# EAGLE design kontroller2 (EAGLE 7.6.0)
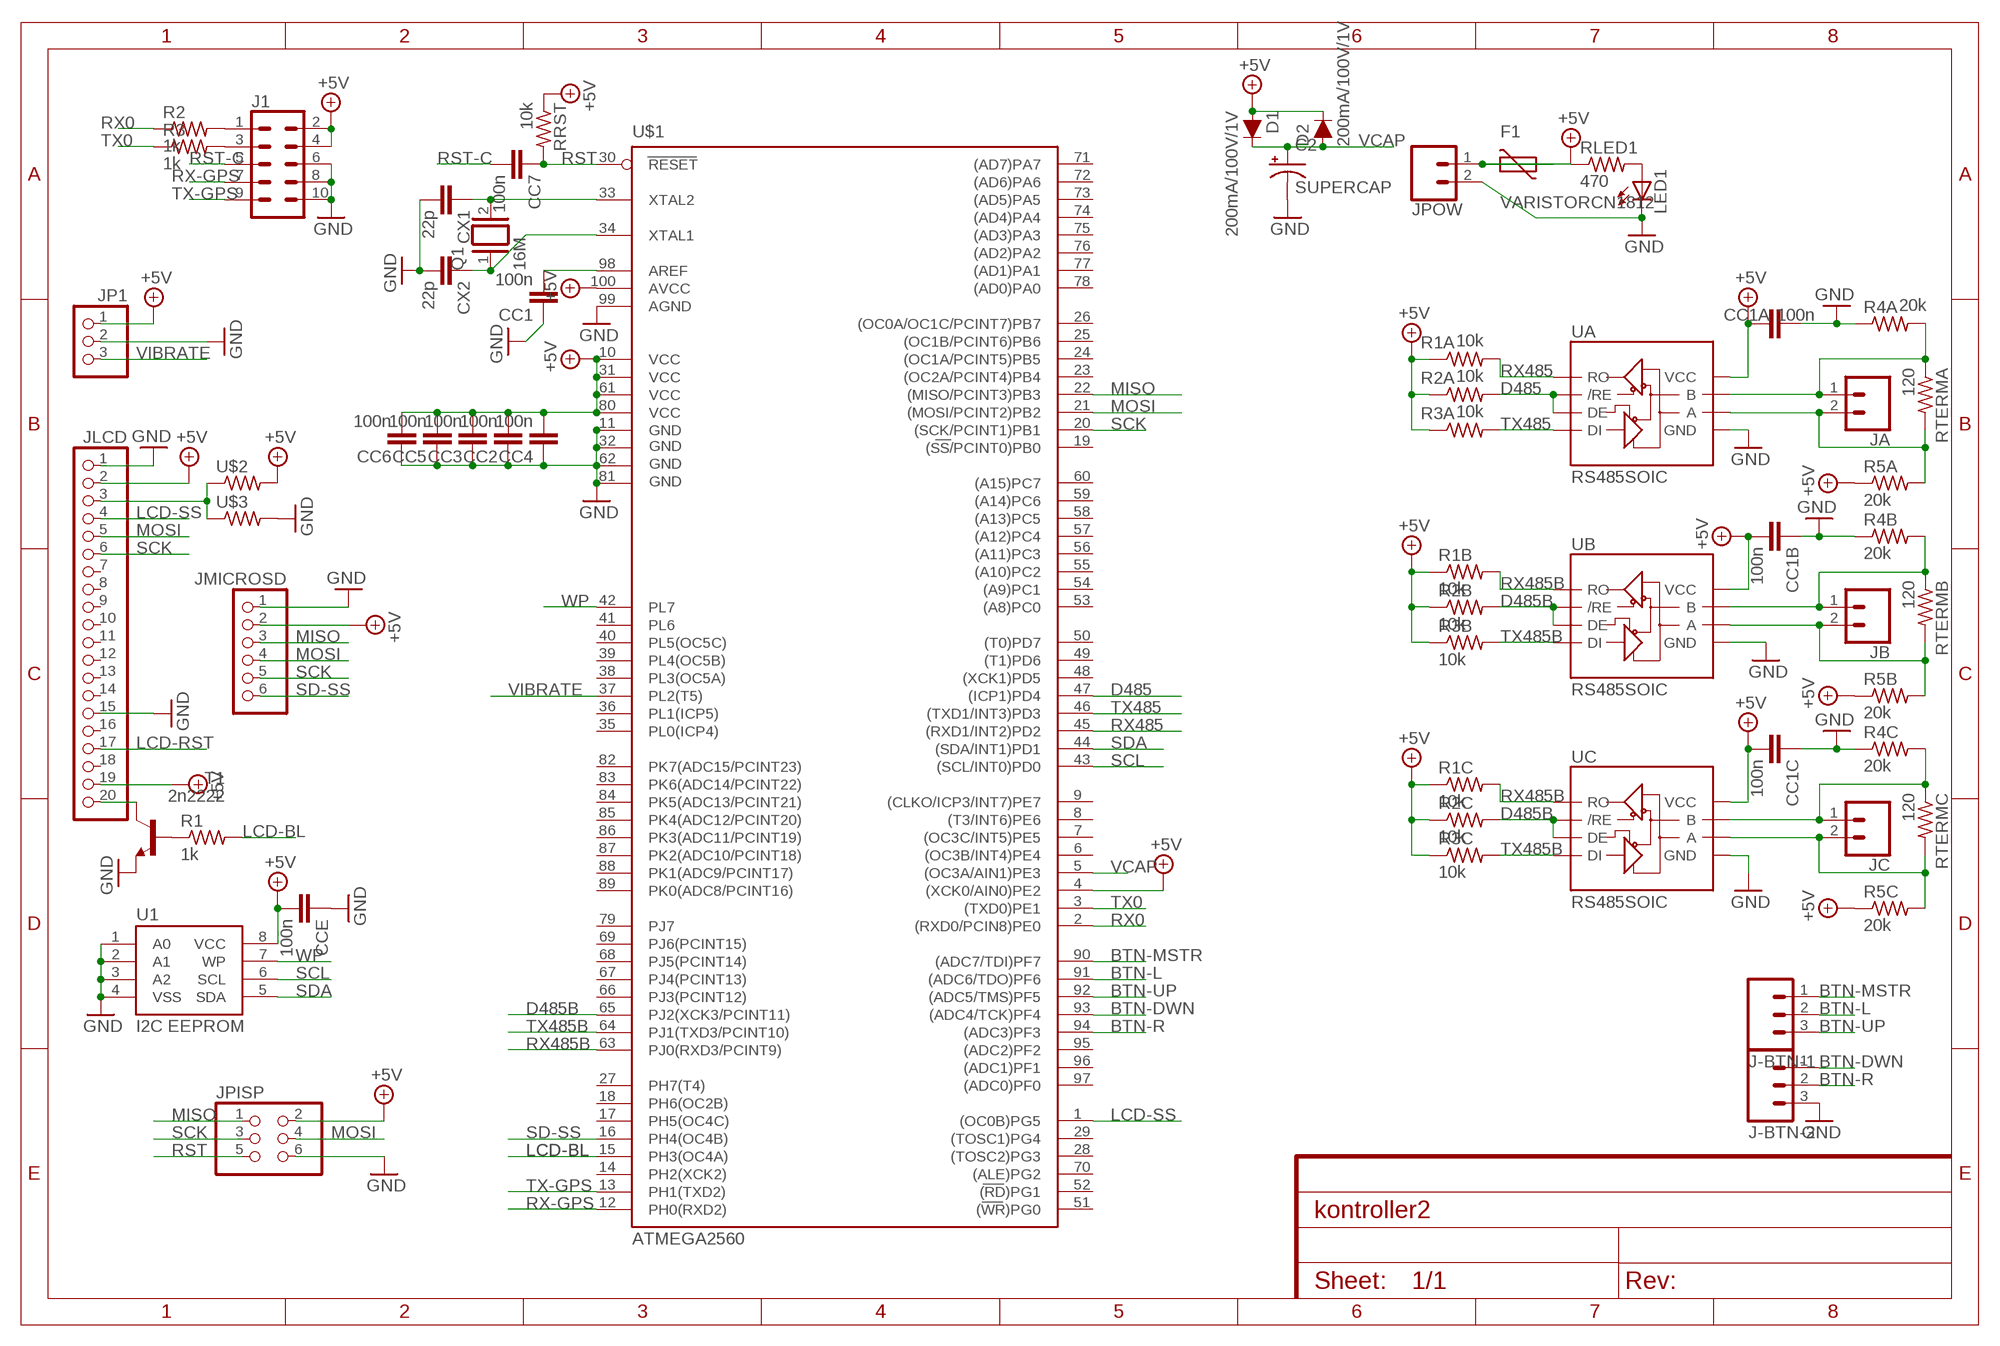
[diagram p0: schematic, sheet 1]

## Parts
C2  SUPERCAP  [SUPERCAP-25MM]
CC1  100n  CAP-NPOL_C0805  [C0805]
CC1A  100n  CAP-NPOL_C0805  [C0805]
CC1B  100n  CAP-NPOL_C0805  [C0805]
CC1C  100n  CAP-NPOL_C0805  [C0805]
CC2  100n  CAP-NPOL_C0805  [C0805]
CC3  100n  CAP-NPOL_C0805  [C0805]
CC4  100n  CAP-NPOL_C0805  [C0805]
CC5  100n  CAP-NPOL_C0805  [C0805]
CC6  100n  CAP-NPOL_C0805  [C0805]
CC7  100n  CAP-NPOL_C0805  [C0805]
CCE  100n  CAP-NPOL_C0805  [C0805]
CX1  22p  CAP-NPOL_C0805  [C0805]
CX2  22p  CAP-NPOL_C0805  [C0805]
D1  200mA/100V/1V  DIODE-1N4148  [DIODE-1N4148]
D2  200mA/100V/1V  DIODE-1N4148  [DIODE-1N4148]
F1  VARISTORCN1812  [CT/CN1812]
J1  CONN_05X2SHD_LOCK  [2X5-SHROUDED_LOCK]
J-BTN-1  M03-SCREW-5MM  [SCREWTERMINAL-5MM-3]
J-BTN-2  M03-SCREW-5MM  [SCREWTERMINAL-5MM-3]
JA  CONN_025MM  [SCREWTERMINAL-5MM-2]
JB  CONN_025MM  [SCREWTERMINAL-5MM-2]
JC  CONN_025MM  [SCREWTERMINAL-5MM-2]
JLCD  PINHD-1X20  [1X20]
JMICROSD  PINHD-1X6  [1X06]
JP1  PINHD-1X3  [1X03]
JPISP  PINHD-2X3  [2X03]
JPOW  CONN_025MM  [SCREWTERMINAL-5MM-2]
LED1  LED3MM  [LED3MM]
Q1  16M  XTAL/S  [QS]
R1  1k  RES_R0805  [R0805]
R1A  10k  RES_R0805  [R0805]
R1B  10k  RES_R0805  [R0805]
R1C  10k  RES_R0805  [R0805]
R2  1k  RES_R0805  [R0805]
R2A  10k  RES_R0805  [R0805]
R2B  10k  RES_R0805  [R0805]
R2C  10k  RES_R0805  [R0805]
R3  1k  RES_R0805  [R0805]
R3A  10k  RES_R0805  [R0805]
R3B  10k  RES_R0805  [R0805]
R3C  10k  RES_R0805  [R0805]
R4A  20k  RES_TH3  [RES-0.3]
R4B  20k  RES_TH3  [RES-0.3]
R4C  20k  RES_TH3  [RES-0.3]
R5A  20k  RES_TH3  [RES-0.3]
R5B  20k  RES_TH3  [RES-0.3]
R5C  20k  RES_TH3  [RES-0.3]
RLED1  470  RES_R0805  [R0805]
RRST  10k  RES_R0805  [R0805]
RTERMA  120  RES_R0805  [R0805]
RTERMB  120  RES_R0805  [R0805]
RTERMC  120  RES_R0805  [R0805]
T1  2n2222  2N2222-NPN-TO92-EBC  [TO92-EBC]
U1  I2C EEPROM  EEPROM-I2CEIAJ  [SO08-EIAJ]
U$1  ATMEGA2560  [TQFP100]
U$2  RES_R0805  [R0805]
U$3  RES_R0805  [R0805]
UA  RS485SOIC  [SO08]
UB  RS485SOIC  [SO08]
UC  RS485SOIC  [SO08]

## Nets
+5V: CC1A.2 CC1B.2 CC1C.2 CC2.2 CC3.2 CC4.2 CC5.2 CC6.2 CCE.2 D1.A D2.C F1.2 J1.2 J1.4 JLCD.2 JLCD.19 JMICROSD.2 JP1.1 JPISP.2 R1A.1 R1B.1 R1C.1 R2A.1 R2B.1 R2C.1 R3A.1 R3B.1 R3C.1 R5A.1 R5B.1 R5C.1 RLED1.1 RRST.1 U1.8(VCC) U$1.4((XCK0/AIN0)PE2) U$1.10(VCC) U$1.31(VCC1) U$1.61(VCC2) U$1.80(VCC3) U$1.100(AVCC) U$2.2 UA.8(VCC) UB.8(VCC) UC.8(VCC)
AREF: CC1.2 U$1.98(AREF)
BTN-DWN: J-BTN-2.1 U$1.93((ADC4/TCK)PF4)
BTN-L: J-BTN-1.2 U$1.91((ADC6/TDO)PF6)
BTN-MSTR: J-BTN-1.1 U$1.90((ADC7/TDI)PF7)
BTN-R: J-BTN-2.2 U$1.94((ADC3)PF3)
BTN-UP: J-BTN-1.3 U$1.92((ADC5/TMS)PF5)
D485: R2A.2 U$1.47((ICP1)PD4) UA.2(/RE) UA.3(DE)
D485B: R2B.2 R2C.2 U$1.65(PJ2(XCK3/PCINT11)) UB.2(/RE) UB.3(DE) UC.2(/RE) UC.3(DE)
GND: C2.- CC1.1 CC1A.1 CC1B.1 CC1C.1 CC2.1 CC3.1 CC4.1 CC5.1 CC6.1 CCE.1 CX1.2 CX2.2 J1.6 J1.8 J1.10 J-BTN-2.3 JLCD.1 JLCD.15 JMICROSD.1 JP1.2 JPISP.6 JPOW.2 LED1.K(C) R4A.1 R4B.1 R4C.1 T1.E U1.1(A0) U1.2(A1) U1.3(A2) U1.4(VSS) U$1.11(GND) U$1.32(GND1) U$1.62(GND2) U$1.81(GND3) U$1.99(AGND) U$3.2 UA.5(GND) UB.5(GND) UC.5(GND)
LCD-BL: R1.2 U$1.15(PH3(OC4A))
LCD-RST: JLCD.17
LCD-SS: JLCD.4 U$1.1((OC0B)PG5)
MISO: JMICROSD.3 JPISP.1 U$1.22((MISO/PCINT3)PB3)
MOSI: JLCD.5 JMICROSD.4 JPISP.4 U$1.21((MOSI/PCINT2)PB2)
N$1: JA.2 R5A.2 RTERMA.2 UA.6(A)
N$2: JC.1 R4C.2 RTERMC.1 UC.7(B)
N$3: JB.1 R4B.2 RTERMB.1 UB.7(B)
N$4: JB.2 R5B.2 RTERMB.2 UB.6(A)
N$5: CX1.1 Q1.2 U$1.33(XTAL2)
N$6: CX2.1 Q1.1 U$1.34(XTAL1)
N$8: LED1.A RLED1.2
N$20: JLCD.3 U$2.1 U$3.1
N$21: JLCD.20 T1.C
N$23: R1.1 T1.B
N$24: J1.1 R2.2
N$25: J1.3 R3.2
N$26: F1.1 JPOW.1
N$28: JC.2 R5C.2 RTERMC.2 UC.6(A)
N$29: JA.1 R4A.2 RTERMA.1 UA.7(B)
RST: CC7.1 JPISP.5 RRST.2 U$1.30(RESET)
RST-C: CC7.2 J1.5
RX0: R2.1 U$1.2((RXD0/PCIN8)PE0)
RX485: R1A.2 U$1.45((RXD1/INT2)PD2) UA.1(RO)
RX485B: R1B.2 R1C.2 U$1.63(PJ0(RXD3/PCINT9)) UB.1(RO) UC.1(RO)
RX-GPS: J1.7 U$1.12(PH0(RXD2))
SCK: JLCD.6 JMICROSD.5 JPISP.3 U$1.20((SCK/PCINT1)PB1)
SCL: U1.6(SCL) U$1.43((SCL/INT0)PD0)
SD-SS: JMICROSD.6 U$1.16(PH4(OC4B))
SDA: U1.5(SDA) U$1.44((SDA/INT1)PD1)
TX0: R3.1 U$1.3((TXD0)PE1)
TX485: R3A.2 U$1.46((TXD1/INT3)PD3) UA.4(DI)
TX485B: R3B.2 R3C.2 U$1.64(PJ1(TXD3/PCINT10)) UB.4(DI) UC.4(DI)
TX-GPS: J1.9 U$1.13(PH1(TXD2))
VCAP: C2.+ D1.C D2.A U$1.5((OC3A/AIN1)PE3)
VIBRATE: JP1.3 U$1.37(PL2(T5))
WP: U1.7(WP) U$1.42(PL7)
Unconnected: JLCD.7 JLCD.8 JLCD.9 JLCD.10 JLCD.11 JLCD.12 JLCD.13 JLCD.14 JLCD.16 JLCD.18 U$1.6((OC3B/INT4)PE4) U$1.7((OC3C/INT5)PE5) U$1.8((T3/INT6)PE6) U$1.9((CLKO/ICP3/INT7)PE7) U$1.14(PH2(XCK2)) U$1.17(PH5(OC4C)) U$1.18(PH6(OC2B)) U$1.19((SS/PCINT0)PB0) U$1.23((OC2A/PCINT4)PB4) U$1.24((OC1A/PCINT5)PB5) U$1.25((OC1B/PCINT6)PB6) U$1.26((OC0A/OC1C/PCINT7)PB7) U$1.27(PH7(T4)) U$1.28((TOSC2)PG3) U$1.29((TOSC1)PG4) U$1.35(PL0(ICP4)) U$1.36(PL1(ICP5)) U$1.38(PL3(OC5A)) U$1.39(PL4(OC5B)) U$1.40(PL5(OC5C)) U$1.41(PL6) U$1.48((XCK1)PD5) U$1.49((T1)PD6) U$1.50((T0)PD7) U$1.51((WR)PG0) U$1.52((RD)PG1) U$1.53((A8)PC0) U$1.54((A9)PC1) U$1.55((A10)PC2) U$1.56((A11)PC3) U$1.57((A12)PC4) U$1.58((A13)PC5) U$1.59((A14)PC6) U$1.60((A15)PC7) U$1.66(PJ3(PCINT12)) U$1.67(PJ4(PCINT13)) U$1.68(PJ5(PCINT14)) U$1.69(PJ6(PCINT15)) U$1.70((ALE)PG2) U$1.71((AD7)PA7) U$1.72((AD6)PA6) U$1.73((AD5)PA5) U$1.74((AD4)PA4) U$1.75((AD3)PA3) U$1.76((AD2)PA2) U$1.77((AD1)PA1) U$1.78((AD0)PA0) U$1.79(PJ7) U$1.82(PK7(ADC15/PCINT23)) U$1.83(PK6(ADC14/PCINT22)) U$1.84(PK5(ADC13/PCINT21)) U$1.85(PK4(ADC12/PCINT20)) U$1.86(PK3(ADC11/PCINT19)) U$1.87(PK2(ADC10/PCINT18)) U$1.88(PK1(ADC9/PCINT17)) U$1.89(PK0(ADC8/PCINT16)) U$1.95((ADC2)PF2) U$1.96((ADC1)PF1) U$1.97((ADC0)PF0)

## Library data of the parts
C2 = edes_lib_160827:SUPERCAP
CC1 CC1A CC1B CC1C CC2-CC7 CCE CX1 CX2 = edes_lib_160827:CAP-NPOL
D1 D2 = SparkFun-DiscreteSemi:DIODE: Diode These are standard reverse protection diodes and small signal diodes. SparkFun Products: SparkFun SparkPunk Sound Kit <https://www.sparkfun.com/products/11177> SparkFun ESP8266 Thing <https://www.sparkfun.com/products/13231>; PROD_ID: DIO-08378
F1 = varistor:VARISTOR: VARISTOR
J1 = edes_lib_160827:CONN_05X2: Multi connection point. Often used as Generic Header-pin footprint for 0.1 inch spaced/style header connections For AVR SPI programming port, see special device with nice symbol: "AVR_SPI_PROG_5x2.dev" You can populate with any combo of single row headers, but if you'd like an exact match, check these: 2x5 AVR ICSP Male Header <https://www.sparkfun.com/products/778> (PRT-00778) 2x5 Pin Shrouded Header <https://www.sparkfun.com/products/8506> (PRT-08506) On any of the 0.1 inch spaced packages, you can populate with these: Break Away Headers - Straight <https://www.sparkfun.com/products/116> (PRT-00116) Break Away Male Headers - Right Angle <https://www.sparkfun.com/products/553> (PRT-00553) Female Headers <https://www.sparkfun.com/products/115> (PRT-00115) Break Away Headers - Machine Pin <https://www.sparkfun.com/products/117> (PRT-00117) Break Away Female Headers - Swiss Machine Pin <https://www.sparkfun.com/products/743> (PRT-00743) Special note: the shrouded connector mates well with our 5x2 ribbon cables: 2x5 Pin IDC Ribbon Cable <https://www.sparkfun.com/products/8535> (PRT-08535); PROD_ID: CONN-08671; SF_ID: PRT-08506
J-BTN-1 J-BTN-2 = SparkFun-Connectors:M03: Header 3 Standard 3-pin 0.1" header. Use with straight break away headers (SKU : PRT-00116), right angle break away headers (PRT-00553), swiss pins (PRT-00743), machine pins (PRT-00117), and female headers (PRT-00115). Molex polarized connector foot print use with SKU : PRT-08232 with associated crimp pins and housings.; STOREFRONT_ID: PRT-08433
JA JB JC JPOW = SparkFun-Connectors:CONN_02: Multi connection point. Often used as Generic Header-pin footprint for 0.1 inch spaced/style header connections On any of the 0.1 inch spaced packages, you can populate with these: Break Away Headers - Straight <https://www.sparkfun.com/products/116> (PRT-00116) Break Away Male Headers - Right Angle <https://www.sparkfun.com/products/553> (PRT-00553) Female Headers <https://www.sparkfun.com/products/115> (PRT-00115) Break Away Headers - Machine Pin <https://www.sparkfun.com/products/117> (PRT-00117) Break Away Female Headers - Swiss Machine Pin <https://www.sparkfun.com/products/743> (PRT-00743) For SCREWTERMINALS and SPRING TERMINALS visit here: Screw Terimnals on SparkFun.com <https://www.sparkfun.com/search/results?term=Screw+Terminals> (5mm/3.5mm/2.54mm spacing) This device is also useful as a general connection point to wire up your design to another part of your project. Our various solder wires solder well into these plated through hole pads. Hook-Up Wire - Assortment (Stranded, 22 AWG) <https://www.sparkfun.com/products/11375> (PRT-11375) Hook-Up Wire - Assortment (Solid Core, 22 AWG) <https://www.sparkfun.com/products/11367> (PRT-11367) View the entire wire category on our website here <https://www.sparkfun.com/categories/141> Special notes: Molex polarized connector foot print use with: PRT-08233 with associated crimp pins and housings. 2.54_SCREWTERM for use with PRT-10571. 3.5mm Screw Terminal footprints for PRT-08084 5mm Screw Terminal footprints for use with PRT-08432; SF_SKU: PRT-08432
JLCD = pinhead:PINHD-1X20: PIN HEADER
JMICROSD = pinhead:PINHD-1X6: PIN HEADER
JP1 = pinhead:PINHD-1X3: PIN HEADER
JPISP = pinhead:PINHD-2X3: PIN HEADER
LED1 = edes_lib_160827:LED: LED OSRAM: - CHIPLED LG R971, LG N971, LY N971, LG Q971, LY Q971, LO R971, LY R971 LH N974, LH R974 LS Q976, LO Q976, LY Q976 LO Q996 - Hyper CHIPLED LW Q18S LB Q993, LB Q99A, LB R99A - SideLED LS A670, LO A670, LY A670, LG A670, LP A670 LB A673, LV A673, LT A673, LW A673 LH A674 LY A675 LS A676, LA A676, LO A676, LY A676, LW A676 LS A679, LY A679, LG A679 - Hyper Micro SIDELED® LS Y876, LA Y876, LO Y876, LY Y876 LT Y87S - SmartLED LW L88C, LW L88S LB L89C, LB L89S, LG L890 LS L89K, LO L89K, LY L89K LS L896, LA L896, LO L896, LY L896 - TOPLED LS T670, LO T670, LY T670, LG T670, LP T670 LSG T670, LSP T670, LSY T670, LOP T670, LYG T670 LG T671, LOG T671, LSG T671 LB T673, LV T673, LT T673, LW T673 LH T674 LS T676, LA T676, LO T676, LY T676, LB T676, LH T676, LSB T676, LW T676 LB T67C, LV T67C, LT T67C, LS T67K, LO T67K, LY T67K, LW E67C LS E67B, LA E67B, LO E67B, LY E67B, LB E67C, LV E67C, LT E67C LW T67C LS T679, LY T679, LG T679 LS T770, LO T770, LY T770, LG T770, LP T770 LB T773, LV T773, LT T773, LW T773 LH T774 LS E675, LA E675, LY E675, LS T675 LS T776, LA T776, LO T776, LY T776, LB T776 LHGB T686 LT T68C, LB T68C - Hyper Mini TOPLED® LB M676 - Mini TOPLED Santana® LG M470 LS M47K, LO M47K, LY M47K Source: http://www.osram.convergy.de LUXEON: - LUMILED® LXK2-PW12-R00, LXK2-PW12-S00, LXK2-PW14-U00, LXK2-PW14-V00 LXK2-PM12-R00, LXK2-PM12-S00, LXK2-PM14-U00 LXK2-PE12-Q00, LXK2-PE12-R00, LXK2-PE12-S00, LXK2-PE14-T00, LXK2-PE14-U00 LXK2-PB12-K00, LXK2-PB12-L00, LXK2-PB12-M00, LXK2-PB14-N00, LXK2-PB14-P00, LXK2-PB14-Q00 LXK2-PR12-L00, LXK2-PR12-M00, LXK2-PR14-Q00, LXK2-PR14-R00 LXK2-PD12-Q00, LXK2-PD12-R00, LXK2-PD12-S00 LXK2-PH12-R00, LXK2-PH12-S00 LXK2-PL12-P00, LXK2-PL12-Q00, LXK2-PL12-R00 Source: www.luxeon.com KINGBRIGHT: KA-3528ASYC Source: www.kingbright.com
Q1 = special:XTAL/S: CRYSTAL
R1 R1A R1B R1C R2 R2A R2B R2C R3 R3A R3B R3C R4A R4B R4C R5A R5B R5C RLED1 RRST RTERMA RTERMB RTERMC U$2 U$3 = edes_lib_160827:RES
T1 = transistor-neu-to92:*-NPN-: NPN Transistror
U1 = SparkFun-IC-Memory:EEPROM-I2C: I2C EEPROMs, 24LC256 and others 24LC256 Series 256 kb I2C 2 Wire (32 k x 8 Bit) 2.5 V Serial EEPROM SMD - SOIC-8 Datasheet SparkFun Products SparkFun UDB5 - PIC UAV Development Board <https://www.sparkfun.com/products/11703> (GPS-11703); PROD_ID: NA-XXXXX
U$1 = edes_lib_160827:ATMEGA2560
UA UB UC = SparkFun-DigitalIC:RS485: RS485 transceiver

## Board
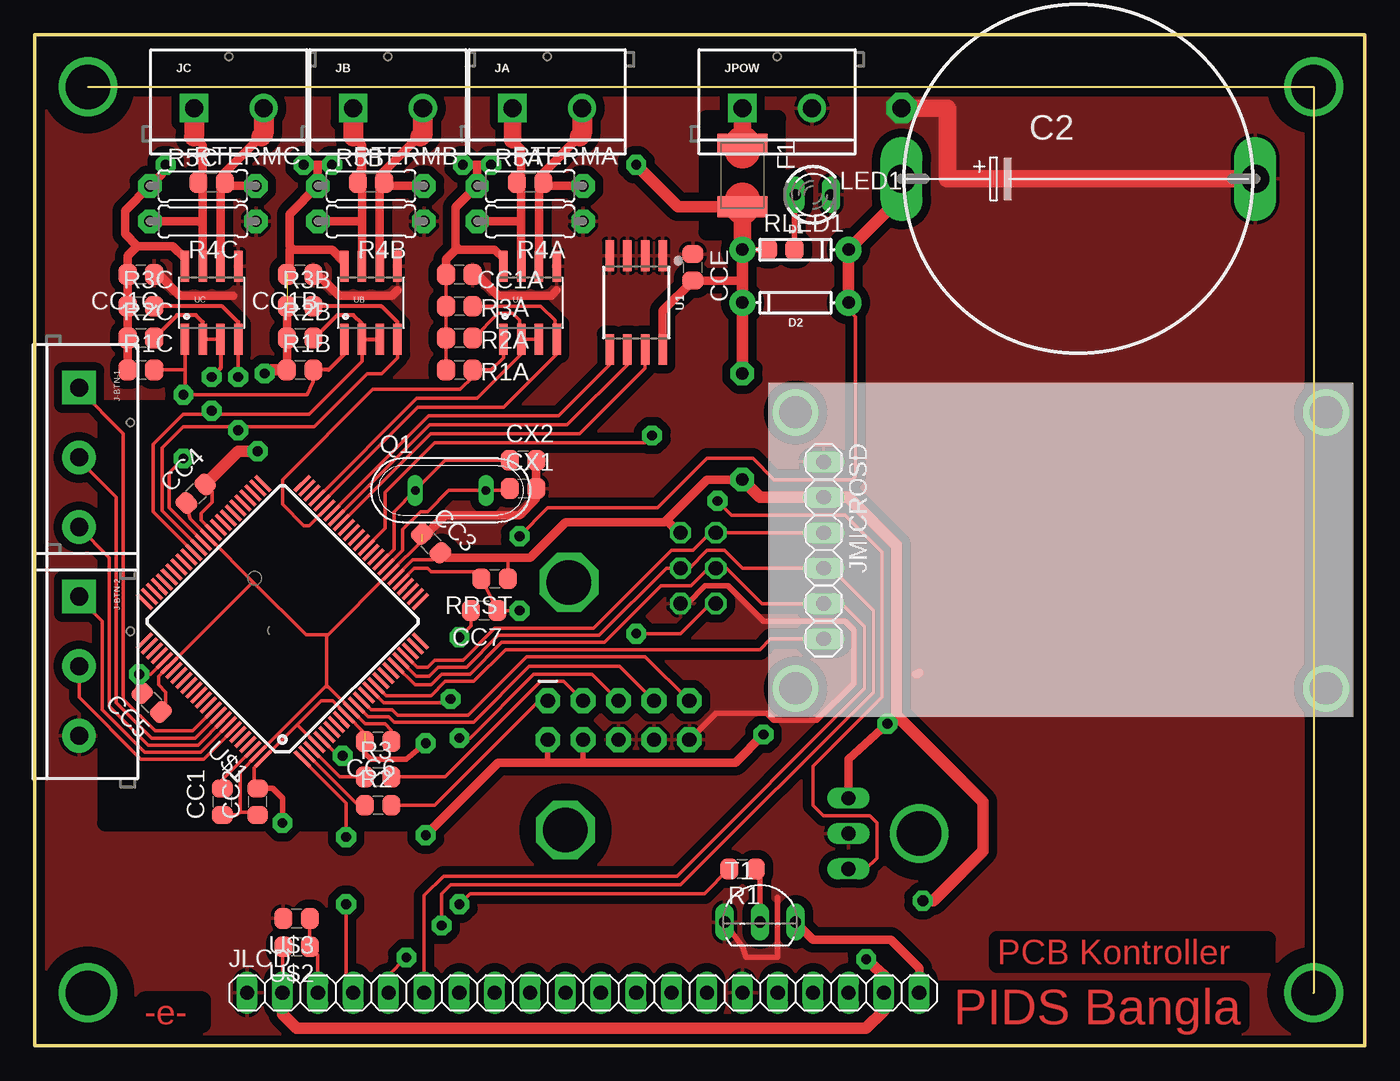
[diagram p1: board, top side]
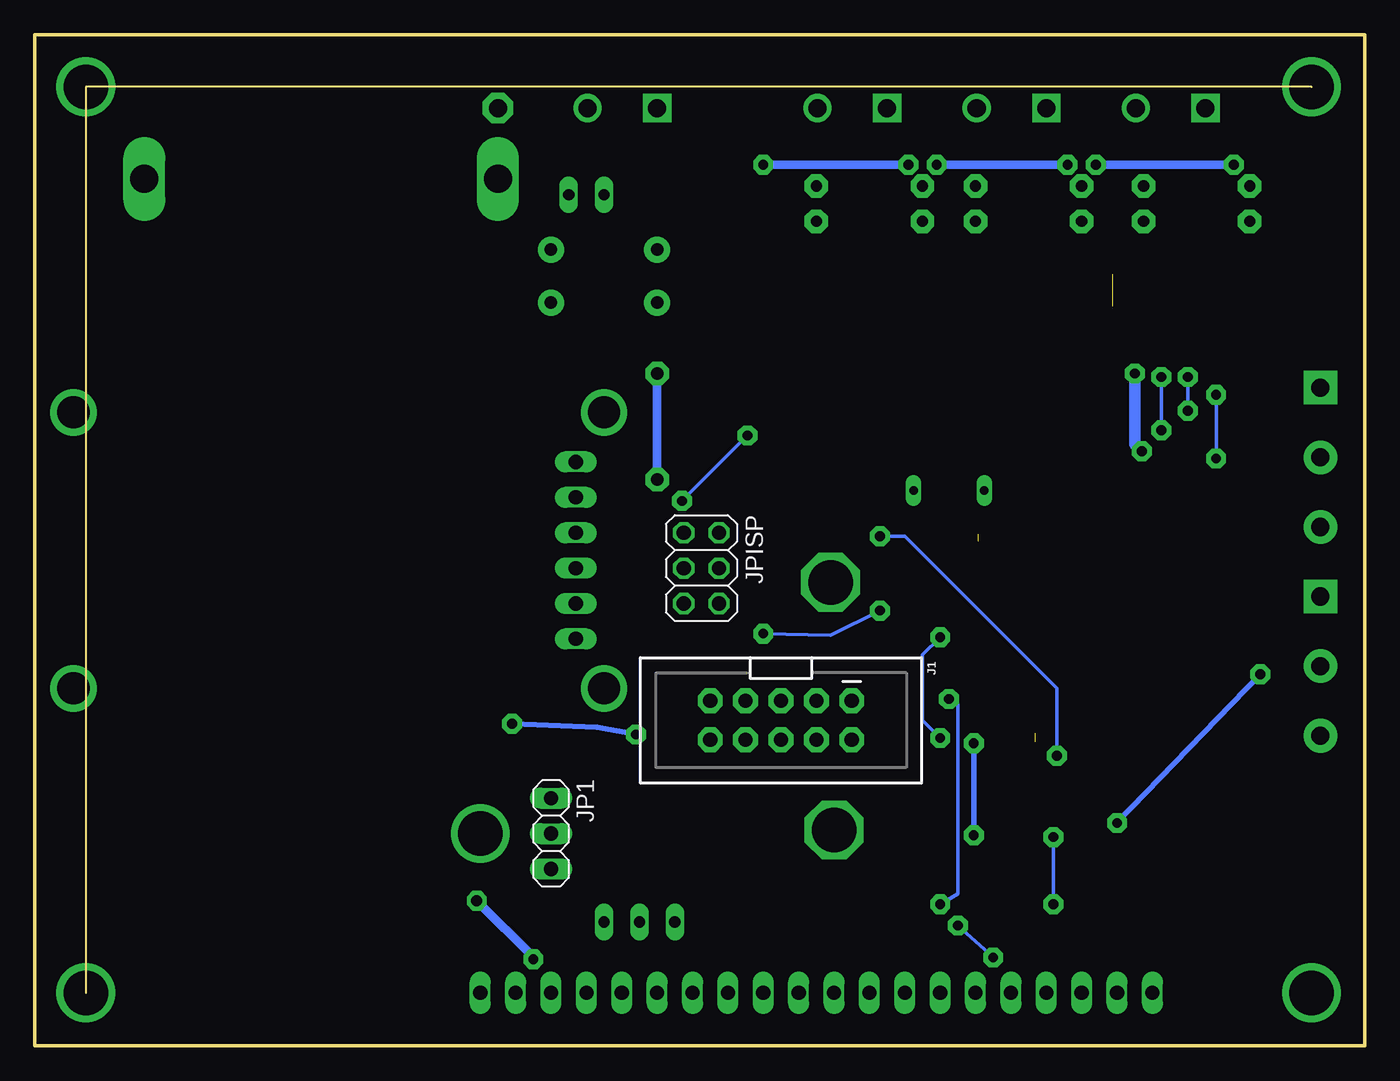
[diagram p2: board, bottom side, seen from below]

Size 95.48 x 72.57 mm. Coordinates in mm from the lower left corner, seen from the top.
Outline: 0,0 95.48,0 95.48,72.57 0,72.57 0,0
Copper layers (1*16): Top 0.035mm / dielectric 1.5mm / Bottom 0.035mm
Design rules "default *": minimum track width 10mil, minimum drill 24mil, track to track 9mil, track to pad 9mil, pad to pad 9mil, via to via 9mil, smd to smd 8mil, copper to edge 20mil, drill to drill 8mil, minimum pad ring 10mil, minimum via ring 8mil, stop-mask expansion 4mil, vias tented up to drill 0mil, thermal gap 10mil
tRestrict: area 89.3,1.3 to 94.3,6.3; area 1.3,1.3 to 6.3,6.3; area 1.3,66.3 to 6.3,71.3; area 89.3,66.3 to 94.3,71.3; area 61,12.7 to 66,17.7; area 35.6,13 to 40.6,18; area 35.9,30.8 to 40.9,35.8; area 5.1,16 to 27.7,45.7; area 48.3,58.4 to 53.3,66.5

### Footprints (pad centres in the part's own frame; a part is rotated, then mirrored left to right if it is on the bottom)
SUPERCAP-25MM = drill 2 pad 2.54 long: + -12.7,0; - 12.7,0
C0805 = smd 1.3 x 1.5: 1 -0.95,0; 2 0.95,0
DIODE-1N4148 = drill 0.9 pad 1.88: A -3.81,0; C 3.81,0
CT/CN1812 = smd 1.5 x 3.6: 1 -2.25,0; 2 2.25,0
2X5-SHROUDED_LOCK = drill 1.016 pad 1.778 octagon: 1 -1.397,5.08; 2 1.397,5.08; 3 -1.397,2.54; 4 1.397,2.54; 5 -1.397,0; 6 1.397,0; 7 -1.397,-2.54; 8 1.397,-2.54; 9 -1.397,-5.08; 10 1.397,-5.08
SCREWTERMINAL-5MM-3 = drill 1.3 pad 2.413 square: 1 0,0 | drill 1.3 pad 2.413: 2 5,0; 3 10,0
SCREWTERMINAL-5MM-2 = drill 1.3 pad 2.032 square: 1 0,0 | drill 1.3 pad 2.032: 2 5,0
1X20 = drill 1.016 long: 1 -24.13,0; 2 -21.59,0; 3 -19.05,0; 4 -16.51,0; 5 -13.97,0; 6 -11.43,0; 7 -8.89,0; 8 -6.35,0; 9 -3.81,0; 10 -1.27,0; 11 1.27,0; 12 3.81,0; 13 6.35,0; 14 8.89,0; 15 11.43,0; 16 13.97,0; 17 16.51,0; 18 19.05,0; 19 21.59,0; 20 24.13,0
1X06 = drill 1.016 long: 1 -6.35,0; 2 -3.81,0; 3 -1.27,0; 4 1.27,0; 5 3.81,0; 6 6.35,0
1X03 = drill 1.016 long: 1 -2.54,0; 2 0,0; 3 2.54,0
2X03 = drill 1.016 octagon: 1 -2.54,-1.27; 2 -2.54,1.27; 3 0,-1.27; 4 0,1.27; 5 2.54,-1.27; 6 2.54,1.27
LED3MM = drill 0.813 pad 1.016 long: A -1.27,0; K 1.27,0
QS = drill 0.61 long: 1 -2.54,0; 2 2.54,0
R0805 = smd 1.3 x 1.5: 1 -0.95,0; 2 0.95,0
RES-0.3 = drill 0.8 pad 1.676 octagon: 1 -3.81,0; 2 3.81,0
TO92-EBC = drill 0.813 long: B 0,-1.27; C 2.54,-1.27; E -2.54,-1.27
SO08-EIAJ = smd 0.61 x 2.21: 1 -1.905,-3.378; 2 -0.635,-3.378; 3 0.635,-3.378; 4 1.905,-3.378; 5 1.905,3.353; 6 0.635,3.353; 7 -0.635,3.353; 8 -1.905,3.353
TQFP100 = smd 1.524 x 0.254: 1 -8,6; 2 -8,5.5; 3 -8,5; 4 -8,4.5; 5 -8,4; 6 -8,3.5; 7 -8,3; 8 -8,2.5; 9 -8,2; 10 -8,1.5; 11 -8,1; 12 -8,0.5; 13 -8,0; 14 -8,-0.5; 15 -8,-1; 16 -8,-1.5; 17 -8,-2; 18 -8,-2.5; 19 -8,-3; 20 -8,-3.5; 21 -8,-4; 22 -8,-4.5; 23 -8,-5; 24 -8,-5.5; 25 -8,-6; 51 8,-6; 52 8,-5.5; 53 8,-5; 54 8,-4.5; 55 8,-4; 56 8,-3.5; 57 8,-3; 58 8,-2.5; 59 8,-2; 60 8,-1.5; 61 8,-1; 62 8,-0.5; 63 8,0; 64 8,0.5; 65 8,1; 66 8,1.5; 67 8,2; 68 8,2.5; 69 8,3; 70 8,3.5; 71 8,4; 72 8,4.5; 73 8,5; 74 8,5.5; 75 8,6 | smd 0.254 x 1.524: 26 -6,-8; 27 -5.5,-8; 28 -5,-8; 29 -4.5,-8; 30 -4,-8; 31 -3.5,-8; 32 -3,-8; 33 -2.5,-8; 34 -2,-8; 35 -1.5,-8; 36 -1,-8; 37 -0.5,-8; 38 0,-8; 39 0.5,-8; 40 1,-8; 41 1.5,-8; 42 2,-8; 43 2.5,-8; 44 3,-8; 45 3.5,-8; 46 4,-8; 47 4.5,-8; 48 5,-8; 49 5.5,-8; 50 6,-8; 76 6,8; 77 5.5,8; 78 5,8; 79 4.5,8; 80 4,8; 81 3.5,8; 82 3,8; 83 2.5,8; 84 2,8; 85 1.5,8; 86 1,8; 87 0.5,8; 88 0,8; 89 -0.5,8; 90 -1,8; 91 -1.5,8; 92 -2,8; 93 -2.5,8; 94 -3,8; 95 -3.5,8; 96 -4,8; 97 -4.5,8; 98 -5,8; 99 -5.5,8; 100 -6,8
SO08 = smd 0.61 x 2.21: 1 -1.905,-2.616; 2 -0.635,-2.616; 3 0.635,-2.616; 4 1.905,-2.616; 5 1.905,2.616; 6 0.635,2.616; 7 -0.635,2.616; 8 -1.905,2.616

### Placement (x,y rotation side)
C2  74.93,62.23 0 top
CC1  13.46,17.53 90 top
CC1A  30.48,55.37 180 top
CC1B  19.05,55.37 180 top
CC1C  7.62,55.37 180 top
CC2  16,17.53 90 top
CC3  28.45,36.07 315 top
CC4  11.56,39.62 45 top
CC5  8.38,24.64 135 top
CC6  24.64,21.84 180 top
CC7  32.26,31.24 180 top
CCE  47.24,55.88 270 top
CX1  35.05,40.01 0 top
CX2  35.05,42.04 0 top
D1  54.61,57.15 0 top
D2  54.61,53.34 180 top
F1  50.8,62.48 270 top
J1  41.91,23.37 270 bottom
J-BTN-1  3.17,47.24 270 top
J-BTN-2  3.17,32.26 270 top
JA  34.29,67.31 0 top
JB  22.86,67.31 0 top
JC  11.43,67.31 0 top
JLCD  39.37,3.81 0 top
JMICROSD  56.64,35.56 270 top
JP1  58.42,15.24 270 bottom
JPISP  47.62,34.29 270 bottom
JPOW  50.8,67.31 0 top
LED1  55.88,61.09 0 top
Q1  29.84,39.88 0 top
R1  50.8,12.7 180 top
R1A  30.48,48.51 0 top
R1B  19.05,48.51 0 top
R1C  7.62,48.51 0 top
R2  24.64,17.27 0 top
R2A  30.48,50.8 0 top
R2B  19.05,50.8 0 top
R2C  7.62,50.8 0 top
R3  24.64,19.3 0 top
R3A  30.48,53.09 0 top
R3B  19.05,53.09 0 top
R3C  7.62,53.09 0 top
R4A  35.56,59.18 180 top
R4B  24.13,59.18 180 top
R4C  12.06,59.18 180 top
R5A  35.56,61.72 0 top
R5B  24.13,61.72 0 top
R5C  12.06,61.72 0 top
RLED1  53.59,57.15 0 top
RRST  33.02,33.53 180 top
RTERMA  35.56,61.98 0 top
RTERMB  24.13,61.98 0 top
RTERMC  12.7,61.98 0 top
T1  52.07,10.16 0 top
U1  43.18,53.34 180 top
U$1  17.78,30.48 135 top
U$2  18.8,7.11 180 top
U$3  18.8,9.14 180 top
UA  35.56,53.34 0 top
UB  24.13,53.34 0 top
UC  12.7,53.34 0 top

### Tracks (layer width: path | path; a pad name or v marks a point on that pad's centre or on a via)
+5V  (via drill 0.7 pad 1.42, 0.8 pad 1.42, 0.9 pad 1.68)  (2 unrouted)
  Top 0.254: CC1A.2 R3A.1 R2A.1 R1A.1 | U$2.2 17.78,7.05 JLCD.2 | U$1.31 27.14,34.89 28.61,34.89 CC3.2 | 23.69,22.45 U$1.10 21.37,24.77 20.55,24.77 18.85,23.06 | U$1.61 11.94,37.74 11.94,38.23 12.74,39.03 12.74,39.79 CC4.2 | CC2.2 16,18.8 15.75,19.05 15.75,19.96 U$1.100 18.85,23.06 | U$1.4 18.85,23.05 18.85,23.06 | U$1.80 8.31,26.67 v7.49,26.67 7.37,25.65 CC5.2 | RRST.1 33.97,34.86 33.78,35.05
  Top 0.406: v17.78,16 17.78,17.78 17.08,18.48 CC2.2 | v61.21,23.11 62.36,23.24 | CC6.2 23.69,21.02 24.13,20.57 26.67,20.57 v28.07,21.72 | J1.2 36.83,20.32 | RLED1.1 D1.A | J1.4 39.37,20.32
  Top 0.61: CC1A.2 29.53,56.45 30.23,57.15 30.48,57.15 | 30.48,57.15 33.02,57.15 33.66,56.52 UA.8 | 7.37,57.4 6.67,56.71 CC1C.2 R3C.1 R2C.1 R1C.1 | 7.37,57.4 9.91,57.4 10.79,56.52 UC.8 | v19.3,63.25 20.32,63.25 | 20.32,63.25 v21.34,63.25 | v30.73,63.25 31.75,63.25 | 31.75,63.25 v32.77,63.25 | U1.8 45.09,52.77 CCE.2 50.73,54.93 50.8,54.86 | v50.8,40.64 48.26,40.64 45.34,37.72 | 45.34,37.72 45.21,37.59 38.1,37.59 35.56,35.05 33.78,35.05 29.54,35.05 CC3.2 | R3B.1 R2B.1 R1B.1 | v52.32,22.35 50.29,20.32 39.37,20.32 36.83,20.32 33.27,20.32 v28.07,15.11 | JPISP.2 46.23,36.83 45.34,37.72 | UB.8 22.23,56.26 21.34,57.15 18.54,57.15 | 18.54,57.15 18.29,57.15 18.29,55.56 CC1B.2 | 18.54,57.15 18.29,57.4 18.29,59.69 R5B.1 20.32,63.25 | 30.48,57.15 30.23,57.4 30.23,60.2 R5A.1 31.75,63.25 | v9.4,63.25 9.14,63.25 9.14,62.61 R5C.1 6.48,59.94 6.48,58.29 7.37,57.4 | JP1.1 58.42,20.57 v61.21,23.11
  Top 0.813: JLCD.2 17.78,2.29 18.8,1.27 59.69,1.27 60.96,2.54 JLCD.19 60.96,5.08 v59.69,6.22 | D1.A 50.8,54.86 D2.C v50.8,48.26 | v50.8,40.64 52.07,39.37 JMICROSD.2 58.42,39.37 61.85,35.94 61.85,23.75 62.36,23.24 68.07,17.53 68.07,13.97 64.52,10.41 v63.75,10.41 | CC4.2 14.61,42.67 v16,42.67 | v16.51,48.26 17.02,48.51 R1B.1 | F1.2 46.19,60.23 v43.18,63.25
  Top 1.27: D1.A F1.2
  Top 2.54: F1.2 50.8,60.71
  Bottom 0.406: v7.49,26.67 v17.78,16 | v52.32,22.35 55.12,22.86 v61.21,23.11 | v28.07,21.72 v28.07,15.11
  Bottom 0.61: v9.4,63.25 v19.3,63.25 | v21.34,63.25 v30.73,63.25 | v32.77,63.25 v43.18,63.25 | v50.8,40.64 v50.8,48.26 | v59.69,6.22 59.69,6.35 v63.75,10.41
  Bottom 0.813: v16,42.67 16.51,43.18 v16.51,48.26
AREF
  Top 0.254: U$1.98 13.46,19.09 CC1.2
BTN-DWN
  Top 0.254: J-BTN-2.1 3.17,32.13 4.83,30.48 4.83,24.13 7.87,21.08 11.92,21.08 U$1.93
BTN-L
  Top 0.254: J-BTN-1.2 3.17,42.04 5.84,39.37 5.84,24.64 8.38,22.1 11.52,22.1 U$1.91
BTN-MSTR
  Top 0.254: J-BTN-1.1 3.17,47.12 6.35,43.94 6.35,24.89 8.64,22.61 11.32,22.61 U$1.90
BTN-R
  Top 0.254: 3.22,27.26 J-BTN-2.2 3.17,25.02 7.62,20.57 12.12,20.57 U$1.94
BTN-UP
  Top 0.254: J-BTN-1.3 3.17,37.21 5.33,35.05 5.33,24.38 8.13,21.59 11.72,21.59 U$1.92
D485
  Top 0.254: UA.2 34.92,49.66 31.75,46.48 27.42,46.48 U$1.47 | UA.2 34.8,50.85 34.8,52.07 34.29,52.58 33.27,52.58 31.5,50.8 R2A.2 | UA.3 UA.2
D485B  (via drill 0.7 pad 1.42)
  Top 0.254: UC.3 UC.2 | U$1.65 8.51,38.34 8.51,43.18 10.67,45.34 12.7,45.34 | UB.2 23.5,49.15 19.68,45.34 12.7,45.34 | v12.7,45.59 12.7,45.34
  Top 0.305: R2B.2 20.25,51.05 20.32,51.05 21.72,52.45 22.86,52.45 23.5,51.82 UB.2 UB.3 | UC.2 12.06,51.94 11.56,52.45 10.22,52.45 R2C.2 | UC.3 13.34,48.64 v12.7,48.01
  Bottom 0.254: v12.7,48.01 v12.7,45.59
GND  (via drill 1.3 pad 2.18)  (1 unrouted)
  Top 0.254: CC6.1 25.59,22.67 25.15,23.11 23.73,23.11 U$1.11 21.07,25.78 20.95,25.78 | CC4.1 11.14,37.83 U$1.62 15.72,33.25 | CC5.1 9.05,24.29 9.4,24.64 9.4,25.4 8.89,25.91 8.89,26.54 U$1.81 15.6,33.25 15.72,33.25 | 14.73,16.76 14.73,19.65 U$1.99 20.86,25.78 20.95,25.78 | 14.73,16.76 14.54,16.58 CC1.1 | CC2.1 15.81,16.76 14.73,16.76 | 21.04,29.5 U$1.32 27.78,36.23 | 21.04,29.5 20.95,29.41 20.95,25.78 | 15.72,33.25 19.46,29.5 21.04,29.5
  Top 0.406: T1.E 50.8,7.11 51.05,6.35 53.34,6.35 53.34,10.67 | JPISP.6 46.86,31.75 48.13,33.02 49.78,33.02 52.32,30.48 58.17,30.48 58.8,29.84 58.8,26.04 56.13,23.37 53.09,23.37 52.58,23.88 48.9,23.88 J1.10
  Top 0.61: 37.47,54.23 37.08,53.85 33.27,53.85 32,55.12 31.68,55.12 CC1A.1 | 26.04,54.23 25.65,53.85 21.84,53.85 20.57,55.12 20.25,55.12 CC1B.1 | CC1C.1 8.89,55.37 10.41,53.85 14.22,53.85 | 63.5,26.8 63.37,26.67 63.25,26.67 | CC3.1 28.12,36.83 28.19,36.83 29.46,38.1 34.8,38.1 36,39.3 CX1.2 CX2.2
  Top 1.27: C2.- 65.53,62.23 65.53,67.31 v62.23,67.31
  pour Top (isolate 0.61): 0,72.64 95.5,72.64 95.5,0 0,0
LCD-BL  (via drill 0.7 pad 1.42)
  Top 0.254: v30.48,10.16 31.24,10.92 48.07,10.92 R1.2 | U$1.15 25.04,24.64 29.59,24.64 v29.84,24.89
  Bottom 0.254: v30.48,10.16 29.21,10.92 29.21,24.51 29.46,24.51 v29.84,24.89
LCD-SS  (via drill 0.7 pad 1.42)
  Top 0.254: U$1.1 22.35,17.42 v22.35,14.99 | JLCD.4 22.86,4.32 22.48,4.7 22.35,4.83 v22.35,10.16
  Bottom 0.254: v22.35,14.99 v22.35,10.16
MISO
  Top 0.254: U$1.22 26.67,27.94 27.43,27.18 28.19,27.18 28.7,27.69 30.73,27.69 33.02,29.97 40.13,29.97 45.72,35.56 47.24,35.56 48.51,36.83 JPISP.1 JMICROSD.3
MOSI  (via drill 0.7 pad 1.42)
  Top 0.254: v26.67,6.35 25.4,5.08 JLCD.5 | v29.21,8.64 29.21,10.92 29.84,11.56 46.35,11.56 60.2,25.4 60.2,31.24 57.15,34.29 JMICROSD.4 50.8,34.29 49.53,35.56 48.26,35.56 46.99,34.29 JPISP.4 45.34,34.29 40.51,29.46 33.27,29.46 30.99,27.18 28.96,27.18 28.32,26.54 27.37,26.54 U$1.21
  Bottom 0.254: v29.21,8.64 v26.67,6.35
N$1
  Top 0.61: 39.29,65.45 36.2,62.36 36.2,61.98 | UA.6 36.2,61.98 | R5A.2 36.76,61.72 RTERMA.2 36.21,61.99 36.2,61.98
  Top 1.422: JA.2 39.29,65.45 39.12,65.28
N$2
  Top 0.61: 11.43,65.28 12.06,64.64 12.06,61.98 | UC.7 12.06,58.93 | 12.06,58.93 12.06,61.98 | R4C.2 11.81,59.18 12.06,58.93 | RTERMC.1 12.06,61.98
  Top 1.422: JC.1 11.43,65.28
N$3
  Top 0.61: UB.7 23.5,59.18 | 23.5,59.18 23.5,63.25 | 23.5,63.25 23.5,64.64 22.86,65.28 | RTERMB.1 23.5,63.25 | R4B.2 23.5,59.18
  Top 1.422: JB.1 22.86,65.28
N$4
  Top 0.61: UB.6 24.77,61.98 | 24.77,61.98 24.77,62.44 27.86,65.53 | R5B.2 25.33,61.72 RTERMB.2 24.77,61.98
  Top 1.422: JB.2 27.86,65.53 27.86,65.45 27.69,65.28
N$5
  Top 0.254: U$1.33 26.42,35.58 26.42,37.08 27.69,38.35 28.19,38.35 29.72,39.88 Q1.2 33.98,39.88 CX1.1
N$6
  Top 0.254: U$1.34 25.78,35.65 25.78,38.35 Q1.1 29.46,42.04 CX2.1
N$8
  Top 0.406: RLED1.2 54.55,60.89 LED1.A
N$10  (via drill 3.2)
  other vias: 3.81,68.83
N$11  (via drill 3.2)
  other vias: 38.35,33.27
N$12  (via drill 3.2)
  other vias: 38.1,15.49
N$13  (via drill 2.3)
  other vias: 54.61,45.47
N$14  (via drill 3.2)
  other vias: 91.82,68.83
N$15  (via drill 3.2)
  other vias: 91.82,3.81
N$16  (via drill 3.2)
  other vias: 3.81,3.81
N$17  (via drill 2.3)
  other vias: 92.71,45.47
N$18  (via drill 2.3)
  other vias: 92.71,25.65
N$19  (via drill 2.3)
  other vias: 54.61,25.65
N$20
  Top 0.254: U$3.1 U$2.1 20.32,6.54 JLCD.3
N$21
  Top 0.61: JLCD.20 63.5,5.59 61.47,7.62 55.88,7.62 T1.C
N$22  (via drill 3.2)
  other vias: 63.5,15.24
N$23
  Top 0.406: R1.1 52.07,11.94 T1.B
N$24
  Top 0.254: R2.2 28.7,17.27 36.2,24.77 J1.1
N$25
  Top 0.254: J1.3 37.97,26.16 36.32,26.16 29.46,19.3 R3.2
N$26
  Top 1.27: JPOW.1 F1.1
  Top 2.54: F1.1 50.8,64.26
N$28
  Top 0.61: RTERMC.2 13.35,61.99 13.34,61.98 | 13.46,62.48 13.34,62.36 13.34,61.98 | 13.46,62.48 16.26,65.28 | UC.6 13.34,61.98 | R5C.2 13.46,61.72 13.46,62.48
  Top 1.422: JC.2 16.43,65.45 16.26,65.28
N$29
  Top 0.61: UA.7 34.92,59.18 | 34.92,59.18 34.92,61.98 | 34.92,61.98 34.92,64.39 34.29,65.02 | R4A.2 34.92,59.18 | RTERMA.1 34.92,61.98
  Top 1.27: JA.1 34.29,65.02
RST  (via drill 0.7 pad 1.42)
  Top 0.254: v43.18,29.59 46.35,29.59 48.51,31.75 JPISP.5 | U$1.30 27.25,34.29 28.19,34.29 28.45,34.04 31.56,34.04 RRST.2 CC7.1 v34.8,31.24
  Bottom 0.254: v43.18,29.59 38.35,29.46 v34.8,31.24
RST-C  (via drill 0.7 pad 1.42)
  Top 0.254: J1.5 40.01,26.67 35.81,26.67 31.24,22.1 v30.48,22.1 | CC7.2 31.31,30.16 v30.48,29.34
  Bottom 0.254: v30.48,22.1 31.75,23.37 31.75,28.07 v30.48,29.34
RX0
  Top 0.254: U$1.2 23.21,17.27 R2.1
RX485
  Top 0.254: U$1.45 19.69,37.34 19.3,37.34 17.78,38.86 17.78,40.64 24.26,47.12 30.54,47.12 31.43,48.01 R1A.2 32.77,48.51 33.66,49.4 UA.1
RX485B  (via drill 0.7 pad 1.42)
  Top 0.254: U$1.63 9.65,38.61 9.65,41.15 v10.67,42.16 | UC.1 10.79,48.51 | 10.79,48.51 10.79,47.37 v10.67,46.74 19.56,46.74 20,47.69 R1B.2 | R1C.2 10.79,48.51
  Top 0.305: UB.1 22.23,49.66 21.08,48.51 R1B.2
  Bottom 0.254: v10.67,42.16 v10.67,46.74
RX-GPS
  Top 0.254: U$1.12 23.93,23.62 25.4,23.62 25.78,23.24 31.5,23.24 35.5,27.24 41.97,27.24 J1.7
SCK
  Top 0.254: JLCD.6 27.94,10.79 29.34,12.19 46.1,12.19 59.56,25.65 59.56,30.1 57.91,31.75 JMICROSD.5 52.2,31.75 49.66,34.29 JPISP.3 48.39,34.29 47.12,33.02 44.96,33.02 40.89,28.96 33.53,28.96 31.24,26.67 29.21,26.67 28.45,25.91 27.3,25.91 U$1.20
SCL
  Top 0.254: U1.6 42.55,48.9 38.23,44.58 28.34,44.58 U$1.43
SD-SS
  Top 0.254: JMICROSD.6 52.83,29.21 52.07,28.45 33.78,28.45 31.5,26.16 29.46,26.16 28.45,25.15 25.23,25.15 U$1.16
SDA
  Top 0.254: U1.5 41.27,48.9 37.59,45.21 28.27,45.21 U$1.44
TX0
  Top 0.254: U$1.3 21.89,19.3 R3.1
TX485
  Top 0.254: R3A.2 36.32,53.09 37.34,52.07 37.34,50.85 UA.4 37.47,49.66 33.66,45.85 27.49,45.85 U$1.46
TX485B  (via drill 0.7 pad 1.42)
  Top 0.254: U$1.64 9.14,38.41 9.14,42.93 10.67,44.45 14.61,44.45 | UC.4 v14.61,48.01 | UB.4 26.04,49.4 24.89,48.26 23.88,48.26 20.07,44.45 14.61,44.45 | v14.61,44.2 14.61,44.45
  Top 0.305: UB.4 26.04,51.94 24.89,53.09 R3B.2 | UC.4 14.61,51.94 13.46,53.09 R3C.2
  Bottom 0.254: v14.61,48.01 v14.61,44.2
TX-GPS
  Top 0.254: U$1.13 24.13,24.13 25.65,24.13 26.04,23.75 31.11,23.75 35.31,27.94 43.81,27.94 J1.9
VCAP  (via drill 0.7 pad 1.42)
  Top 0.254: U$1.5 21.77,20.83 v22.1,20.83 | D2.A 58.42,52.83 58.93,52.32 58.93,40.89 58.67,40.64 53.09,40.64 51.56,42.16 48.26,42.16 44.7,38.61 36.83,38.61 v34.8,36.58
  Top 0.813: D2.A D1.C 61.98,60.71 C2.+
  Bottom 0.254: v34.8,36.58 33.02,36.58 22.1,25.65 v22.1,20.83
VIBRATE  (via drill 0.7 pad 1.42)
  Top 0.254: v49.02,39.12 50.04,38.1 58.17,38.1 60.83,35.43 60.83,25.02 55.88,20.07 55.88,17.27 56.64,16.51 59.94,16.51 60.45,16 60.45,13.46 59.69,12.7 JP1.3 | U$1.37 25.15,37.14 25.15,39.75 28.7,43.31 43.81,43.31 v44.32,43.81
  Bottom 0.254: v49.02,39.12 v44.32,43.81
WP
  Top 0.254: U1.7 43.81,48.64 39.12,43.94 28.41,43.94 U$1.42

### Text on the board
Top: PCB Kontroller | PIDS Bangla | -e-